# EAGLE design ESP32-Tinkler (EAGLE 8.1.1)
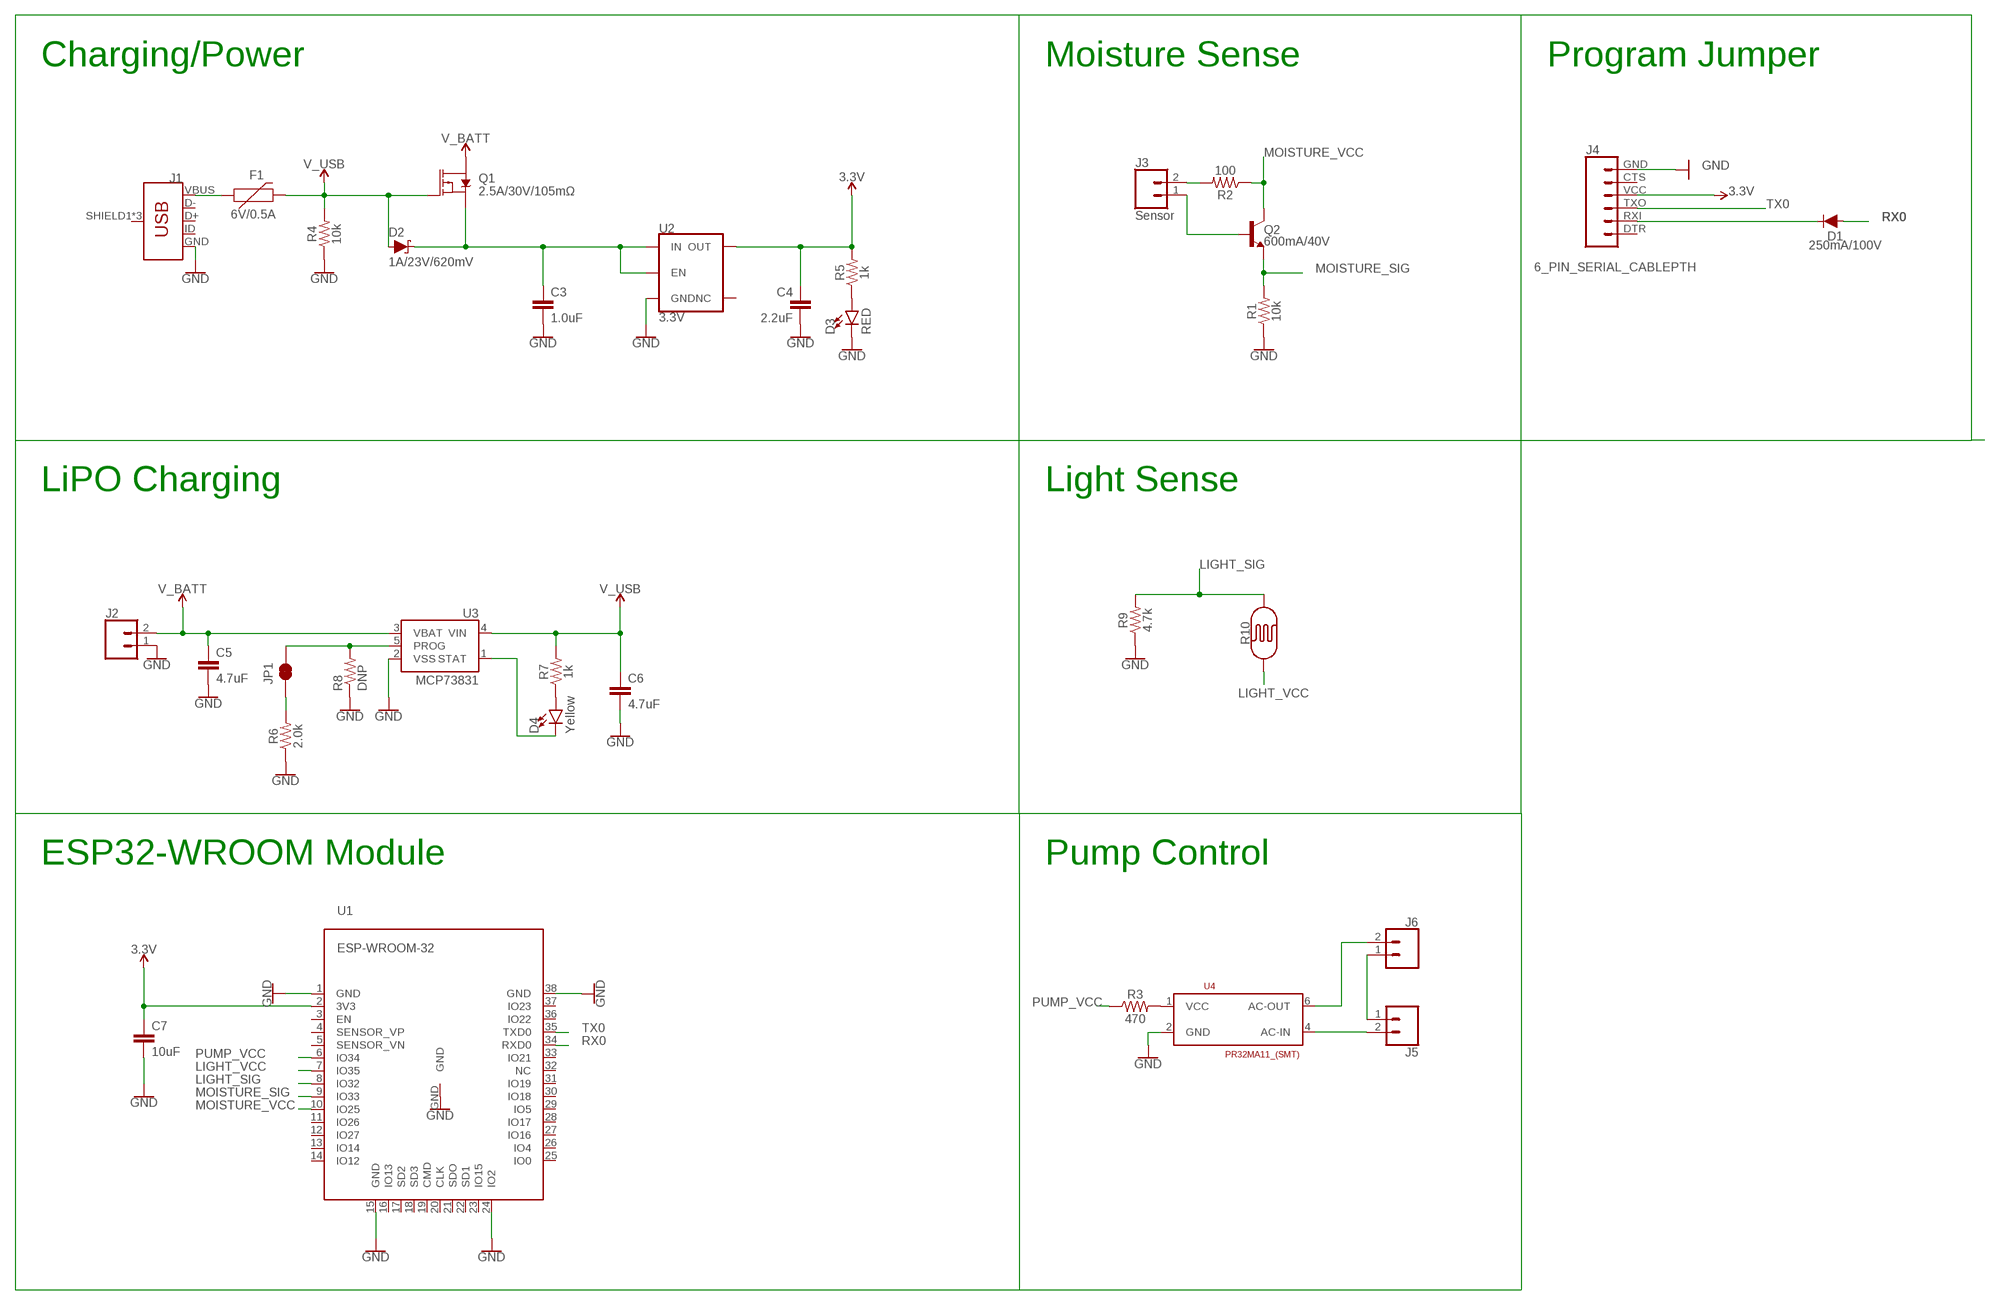
[diagram p0: schematic, sheet 1]

## Parts
C3  1.0uF  1.0UF-0603-16V-10%  [0603]
C4  2.2uF  2.2UF-0603-10V-20%  [0603]
C5  4.7uF  4.7UF0603  [0603]
C6  4.7uF  4.7UF0603  [0603]
C7  10uF  10UF-0603-6.3V-20%  [0603]
D1  250mA/100V  DIODE-BAS16J  [SOD-323]
D2  1A/23V/620mV  DIODE-SCHOTTKY-BAT20J  [SOD-323]
D3  RED  LED-RED0603  [LED-0603]
D4  Yellow  LED-YELLOW0603  [LED-0603]
F1  6V/0.5A  PPTC_HALF-AMP  [1206]
J1  USB_MICRO-B_FEMALE-SMT  [USB-B-MICRO-SMD]
J2  CONN_02JST-PTH-2  [JST-2-PTH]
J3  Sensor  CONN_02JST-PTH-2  [JST-2-PTH]
J4  6_PIN_SERIAL_CABLEPTH  [FTDI_BASIC]
J5  CONN_02PTH4  [1X02_XTRA_BIG]
J6  CONN_02PTH4  [1X02_XTRA_BIG]
JP1  JUMPER-SMT_2_NC_TRACE_SILK  [SMT-JUMPER_2_NC_TRACE_SILK]
Q1  2.5A/30V/105mΩ  MOSFET_PCH-DMG2307L  [SOT23-3]
Q2  600mA/40V  TRANS_NPN-MMBT2222AL  [SOT23-3]
R1  10k  10KOHM-0603-1/10W-1%  [0603]
R2  100  100OHM-0603-1/4W-5%  [0603]
R3  470  470OHM-0603-1/10W-1%  [0603]
R4  10k  10KOHM-0603-1/10W-1%  [0603]
R5  1k  1KOHM-0603-1/10W-1%  [0603]
R6  2.0k  2.0KOHM-0603-1/10W-5%  [0603]
R7  1k  1KOHM-0603-1/10W-1%  [0603]
R8  DNP  RESISTOR0603-RES  [0603-RES]
R9  4.7k  4.7KOHM-0603-1/10W-1%  [0603]
R10  PHOTOCELLPTH-KIT  [PHOTOCELL-KIT]
U1  ESP-WROOM-32  [ESP-WROOM-32]
U2  3.3V  V_REG_AP2112K-3.3V  [SOT23-5]
U3  MCP73831  [SOT23-5]
U4  PR32MA11_(SMT)  [SMT-GULLWING]

## Nets
3.3V: C4.1 C7.1 J4.VCC R5.2 U1.2(3V3) U2.5(OUT)
GND: C3.2 C4.2 C5.2 C6.2 C7.2 D3.C J1.GND J2.1 J4.GND R1.1 R4.1 R6.1 R8.1 R9.1 U1.1(GND) U1.15(GND) U1.24(IO2) U1.38(GND) U1.GND U2.2(GND) U3.2(VSS) U4.2(GND)
LIGHT_SIG: R9.2 R10.2 U1.8(IO32)
LIGHT_VCC: R10.1 U1.7(IO35)
MOISTURE_SIG: Q2.2(E) R1.2 U1.9(IO33)
MOISTURE_VCC: Q2.3(C) R2.1 U1.10(IO25)
N$1: J3.2 R2.2
N$2: F1.1 J1.VBUS
N$3: C3.1 D2.C Q1.2(S) U2.1(IN) U2.3(EN)
N$4: J3.1 Q2.1(B)
N$5: D1.C J4.RXI
N$6: JP1.2 R8.2 U3.5(PROG)
N$7: D3.A R5.1
N$9: D4.A R7.1
N$10: JP1.1 R6.2
N$11: J5.1 J6.1
N$12: D4.C U3.1(STAT)
N$13: J6.2 U4.6(AC-OUT)
N$14: J5.2 U4.4(AC-IN)
N$16: R3.2 U4.1(VCC)
PUMP_VCC: R3.1 U1.6(IO34)
RX0: D1.A U1.34(RXD0)
TX0: J4.TXO U1.35(TXD0)
V_BATT: C5.1 J2.2 Q1.3(D) U3.3(VBAT)
V_USB: C6.1 D2.A F1.2 Q1.1(G) R4.2 R7.2 U3.4(VIN)
Unconnected: J1.D+ J1.D- J1.ID J1.SHIELD1(SHIELD) J1.SHIELD2(SHIELD) J1.SHIELD3(SHIELD) J4.CTS J4.DTR U1.3(EN) U1.4(SENSOR_VP) U1.5(SENSOR_VN) U1.11(IO26) U1.12(IO27) U1.13(IO14) U1.14(IO12) U1.16(IO13) U1.17(SD2) U1.18(SD3) U1.19(CMD) U1.20(CLK) U1.21(SDO) U1.22(SD1) U1.23(IO15) U1.25(IO0) U1.26(IO4) U1.27(IO16) U1.28(IO17) U1.29(IO5) U1.30(IO18) U1.31(IO19) U1.32(NC) U1.33(IO21) U1.36(IO22) U1.37(IO23) U2.4(NC)

## Notes on the sheet
- Charging/Power | Moisture Sense | Program Jumper
- LiPO Charging | Light Sense
- ESP32-WROOM Module | Pump Control

## Library data of the parts
C3 = SparkFun-Capacitors:1.0UF: 1µF ceramic capacitors A capacitor is a passive two-terminal electrical component used to store electrical energy temporarily in an electric field.; PROD_ID: CAP-00868
C4 = SparkFun-Capacitors:2.2UF: 2.2µF ceramic capacitors A capacitor is a passive two-terminal electrical component used to store electrical energy temporarily in an electric field.; PROD_ID: CAP-07888
C5 C6 = SparkFun-Capacitors:4.7UF: 4.7µF ceramic capacitors A capacitor is a passive two-terminal electrical component used to store electrical energy temporarily in an electric field.; PROD_ID: CAP-08280
C7 = SparkFun-Capacitors:10UF: 10.0µF ceramic capacitors A capacitor is a passive two-terminal electrical component used to store electrical energy temporarily in an electric field.; PROD_ID: CAP-11015
D1 = SparkFun-DiscreteSemi:DIODE: Diode These are standard reverse protection diodes and small signal diodes. SparkFun Products: SparkFun SparkPunk Sound Kit <https://www.sparkfun.com/products/11177> SparkFun ESP8266 Thing <https://www.sparkfun.com/products/13231>; PROD_ID: DIO-09646
D2 = SparkFun-DiscreteSemi:DIODE-SCHOTTKY: Schottky diode A Schottky diode is a semiconductor diode which has a low forward voltage drop and a very fast switching action.; PROD_ID: DIO-11623
D3 = SparkFun-LED:LED-RED: Red SMD LED Used in manufacturing of most products at SparkFun Packages: 0603 - SMD 0603 package [Product Link] <http://docs.avagotech.com/docs/AV02-0551EN> 0603 SMART - SMD 0603 SMART package ( more efficient and expensive)[Product Link] <http://www.osram-os.com/Graphics/XPic2/00077099_0.pdf> 1206 - SMD1206 package [Product Link] <https://www.sparkfun.com/datasheets/DevTools/LilyPad/Q150OVS4.pdff> SparkFun Products: Pro Mini 328 -5V <https://www.sparkfun.com/products/821> RedBoard <https://www.sparkfun.com/products/12757> IOIO-OTG <https://www.sparkfun.com/products/13613>; PROD_ID: DIO-00819
D4 = SparkFun-LED:LED-YELLOW: Yellow SMD LED Used in manufacturing several products at SparkFun. Packages: 0603 - SMD 0603 package[Product Link] <http://www.kingbrightusa.com/product.asp?catalog_name=LED&product_id=APT1608SYCK> 0603 -SMART - SMART SMD 0603 package (more efficient/more expensive) [Product Link] <http://www.osram-os.com/osram_os/en/products/product-catalog/led-light-emitting-diodes/smartled-0603/ly-l29k/index.jsp> LilyPad - SMD1206 package[Product Datasheet] <https://www.sparkfun.com/datasheets/DevTools/LilyPad/Q150YUS4.pdf> SparkFun Products: Blynk Board <https://www.sparkfun.com/products/13794> IOIO-OTG <https://www.sparkfun.com/products/13613> XBee Explorer Serial <https://www.sparkfun.com/products/13225>; PROD_ID: DIO-09003
F1 = SparkFun-Fuses:PPTC: Resettable Fuse PPTC Resettable Fuse. Really a sort of resistor with a polymeric positive temperature coefficient whose resistance increases dramatically with an increase in temperature. When heated by the power passing through the resistance rises causing the current to be limited, protecting the circuit. This is achieved by the transition of the polymer from a crystalline to an amorphous state where the conductive carbon separates breaking the conductive pathways found in the cool crystalline structure. When a PPTC cools back down it resumes conducting letting the circuit turn back on. SparkFun Products: SparkFun RedBoard - Programmed with Arduino <https://www.sparkfun.com/products/12757> Pro Micro - 5V/16MHz <https://www.sparkfun.com/products/12640> Arduino Pro 328 - 5V/16MHz <https://www.sparkfun.com/products/10915> MP3 Trigger <https://www.sparkfun.com/products/13720>; PROD_ID: RES-08585
J1 = SparkFun-Connectors:USB_MICRO-B: USB Type Micro-B Connector Male/female and PTH/SMT variants SparkFun Products: SparkFun microB USB Breakout <https://www.sparkfun.com/products/12035> SparkFun USB microB Plug Breakout <https://www.sparkfun.com/products/10031> SparkFun ESP8266 Thing <https://www.sparkfun.com/products/13231>; PROD_ID: CONN-11752
J2 J3 = SparkFun-Connectors:CONN_02: Multi connection point. Often used as Generic Header-pin footprint for 0.1 inch spaced/style header connections On any of the 0.1 inch spaced packages, you can populate with these: Break Away Headers - Straight <https://www.sparkfun.com/products/116> (PRT-00116) Break Away Male Headers - Right Angle <https://www.sparkfun.com/products/553> (PRT-00553) Female Headers <https://www.sparkfun.com/products/115> (PRT-00115) Break Away Headers - Machine Pin <https://www.sparkfun.com/products/117> (PRT-00117) Break Away Female Headers - Swiss Machine Pin <https://www.sparkfun.com/products/743> (PRT-00743) For SCREWTERMINALS and SPRING TERMINALS visit here: Screw Terimnals on SparkFun.com <https://www.sparkfun.com/search/results?term=Screw+Terminals> (5mm/3.5mm/2.54mm spacing) This device is also useful as a general connection point to wire up your design to another part of your project. Our various solder wires solder well into these plated through hole pads. Hook-Up Wire - Assortment (Stranded, 22 AWG) <https://www.sparkfun.com/products/11375> (PRT-11375) Hook-Up Wire - Assortment (Solid Core, 22 AWG) <https://www.sparkfun.com/products/11367> (PRT-11367) View the entire wire category on our website here <https://www.sparkfun.com/categories/141> Special notes: Molex polarized connector foot print use with: PRT-08233 with associated crimp pins and housings. 2.54_SCREWTERM for use with PRT-10571. 3.5mm Screw Terminal footprints for PRT-08084 5mm Screw Terminal footprints for use with PRT-08432; PROD_ID: CONN-09863; SKU: PRT-09914
J4 = SparkFun-Connectors:6_PIN_SERIAL_CABLE: 6-pin header connection for use with the "FTDI BASIC" pinout - CABLE SIDE. Also known as "Arduino Serial Program Header". This is used on a design to provide a 6-pin connection point for serial communication usually from a USB cable (D+/D-) to these headers (RX/TX). It also has the remaining pins necessary for programming in the Arduino evironment (DTR, GND, and sometimes VCC). Note, this device has "CABLE" in the name. It is intended to be used on a design that usually lives on the end of your USB cable and prvides the converter chip (FTDI232 or FTDI231x) to commnicate serial RX/TX. The "sister" device, named "TARGET" is inteneded to be used on a design that contains a target micro-controller that you wish to program. You can populate with some of these: Female Headers <https://www.sparkfun.com/products/115> (PRT-00115) For reference (or to suit your programming needs) check out these designs: SparkFun FTDI Basic Breakout - 5V <https://www.sparkfun.com/products/9716> (DEV-09716) SparkFun FTDI Basic Breakout - 3.3V <https://www.sparkfun.com/products/9873> (DEV-09873) SparkFun FTDI SmartBasic <https://www.sparkfun.com/products/12935> (DEV-12935) SparkFun Beefy 3 - FTDI Basic Breakout <https://www.sparkfun.com/products/13746> (DEV-13746)
J5 J6 = SparkFun-Connectors:CONN_02: Multi connection point. Often used as Generic Header-pin footprint for 0.1 inch spaced/style header connections On any of the 0.1 inch spaced packages, you can populate with these: Break Away Headers - Straight <https://www.sparkfun.com/products/116> (PRT-00116) Break Away Male Headers - Right Angle <https://www.sparkfun.com/products/553> (PRT-00553) Female Headers <https://www.sparkfun.com/products/115> (PRT-00115) Break Away Headers - Machine Pin <https://www.sparkfun.com/products/117> (PRT-00117) Break Away Female Headers - Swiss Machine Pin <https://www.sparkfun.com/products/743> (PRT-00743) For SCREWTERMINALS and SPRING TERMINALS visit here: Screw Terimnals on SparkFun.com <https://www.sparkfun.com/search/results?term=Screw+Terminals> (5mm/3.5mm/2.54mm spacing) This device is also useful as a general connection point to wire up your design to another part of your project. Our various solder wires solder well into these plated through hole pads. Hook-Up Wire - Assortment (Stranded, 22 AWG) <https://www.sparkfun.com/products/11375> (PRT-11375) Hook-Up Wire - Assortment (Solid Core, 22 AWG) <https://www.sparkfun.com/products/11367> (PRT-11367) View the entire wire category on our website here <https://www.sparkfun.com/categories/141> Special notes: Molex polarized connector foot print use with: PRT-08233 with associated crimp pins and housings. 2.54_SCREWTERM for use with PRT-10571. 3.5mm Screw Terminal footprints for PRT-08084 5mm Screw Terminal footprints for use with PRT-08432
JP1 = SparkFun-Jumpers:JUMPER-SMT_2_NC_TRACE: Normally closed trace jumper This jumper has a trace between two pads so it's normally closed (NC). Use a razor knife to open the connection. For best results follow the IPC guidelines for cutting traces: Cutout at least 0.063 mm (0.005 in). Remove all loose material to clean up the cut area. Seal the cut with an approved epoxy. Reapply solder to reclose the connection.
Q1 = SparkFun-DiscreteSemi:MOSFET_PCH: P-channel MOSFETs Voltage controlled devices that allow control of high current outputs. SparkFun Products: SparkFun ESP32 Thing <https://www.sparkfun.com/products/13907> SparkFun ESP8266 Thing <https://www.sparkfun.com/products/13231>; PROD_ID: TRANS-11308
Q2 = SparkFun-DiscreteSemi:TRANS_NPN: NPN transistor Current controlled devices typically used to amplify current or used as a switch. BC547 - COM-08928 <http://www.sparkfun.com/products/8928> (TO-92 45V 100mA) (1.Collector 2.Base 3.Emitter) 2N3904 - COM-00521 <http://www.sparkfun.com/products/521> (TO-92 40V 200mA) (1.Emitter 2.Base 3.Collector) P2N2222A - COM-12852 <http://www.sparkfun.com/products/12852> (TO-92 40V 600mA) (1.Collector 2.Base 3.Emitter); PROD_ID: TRANS-08049
R1 R4 = SparkFun-Resistors:10KOHM: 10kΩ resistor A resistor is a passive two-terminal electrical component that implements electrical resistance as a circuit element. Resistors act to reduce current flow, and, at the same time, act to lower voltage levels within circuits. - Wikipedia; PROD_ID: RES-00824
R2 = SparkFun-Resistors:100OHM: 100Ω resistor A resistor is a passive two-terminal electrical component that implements electrical resistance as a circuit element. Resistors act to reduce current flow, and, at the same time, act to lower voltage levels within circuits. - Wikipedia; PROD_ID: RES-12438
R3 = SparkFun-Resistors:470OHM: 470Ω resistor A resistor is a passive two-terminal electrical component that implements electrical resistance as a circuit element. Resistors act to reduce current flow, and, at the same time, act to lower voltage levels within circuits. - Wikipedia; PROD_ID: RES-07869
R5 R7 = SparkFun-Resistors:1KOHM: 1kΩ resistor A resistor is a passive two-terminal electrical component that implements electrical resistance as a circuit element. Resistors act to reduce current flow, and, at the same time, act to lower voltage levels within circuits. - Wikipedia; PROD_ID: RES-07856
R6 = SparkFun-Resistors:2.0KOHM: 2kΩ resistor A resistor is a passive two-terminal electrical component that implements electrical resistance as a circuit element. Resistors act to reduce current flow, and, at the same time, act to lower voltage levels within circuits. - Wikipedia; PROD_ID: RES-08296
R8 = SparkFun-Passives:RESISTOR: Resistor Basic schematic elements and footprints for 0603, 1206, and PTH resistors.
R9 = SparkFun-Resistors:4.7KOHM: 4.7kΩ resistor A resistor is a passive two-terminal electrical component that implements electrical resistance as a circuit element. Resistors act to reduce current flow, and, at the same time, act to lower voltage levels within circuits. - Wikipedia; PROD_ID: RES-07857
R10 = SparkFun-Sensors:PHOTOCELL: Photocell (Photodetector, Photo Resistor, CdS) This is a very small light sensor. A photocell changes (also called a photodetector, photo resistor, CdS or photoconductive cell) resistance depending on the amount of light it is exposed to. These little sensors make great ambient light triggers (when light in the room turns on, do something). Datasheet <http://cdn.sparkfun.com/datasheets/Sensors/LightImaging/SEN-09088.pdf> SparkFun Products Mini Photocell <https://www.sparkfun.com/products/9088> (SEN-09088); PROD_ID: COMP-09129; SF_ID: SEN-09088
U1 = esp32:ESP-WROOM-32
U2 = SparkFun-IC-Power:V_REG_AP2112: AP2112 - 600mA CMOS LDO Regulator w/ Enable The AP2112 is CMOS process low dropout linear regulator with enable function, the regulator delivers a guaranteed 600mA (min.) continuous load current. Features Output Voltage Accuracy: ±1.5% Output Current: 600mA (Min.) Foldback Short Current Protection: 50mA Enable Function to Turn ON/OFF VOUT Low Dropout Voltage (3.3V): 250mV (Typ.) @IOUT=600mA Excellent Load Regulation: 0.2%/A (Typ.) Excellent Line Regulation: 0.02%/V (Typ.) Low Quiescent Current: 55μA (Typ.) Low Standby Current: 0.01μA (Typ.) Low Output Noise: 50μVRMS PSRR: 100Hz -65dB, 1kHz -65dB OTSD Protection Stable with 1.0μF Flexible Cap: Ceramic, Tantalum and Aluminum Electrolytic Operation Temperature Range: -40°C to 85°C ESD: MM 400V, HBM 4000V; PROD_ID: VREG-12457
U3 = SparkFun-IC-Power:MCP73831: MCP73831T Li-Ion, Li-Pol Controller Miniature single cell, fully integrated Li-Ion, Li-polymer charge management controller Datasheet <http://ww1.microchip.com/downloads/en/DeviceDoc/20001984g.pdf> SparkFun Products: SparkFun ESP32 Thing <https://www.sparkfun.com/products/13907> SparkFun 9DoF Razor IMU M0 <https://www.sparkfun.com/products/14001>; PROD_ID: IC-09995
U4 = SparkFun-DiscreteSemi:PR32MA11_(SMT): PR32MA11 Solid State Relay (600V)

## Board
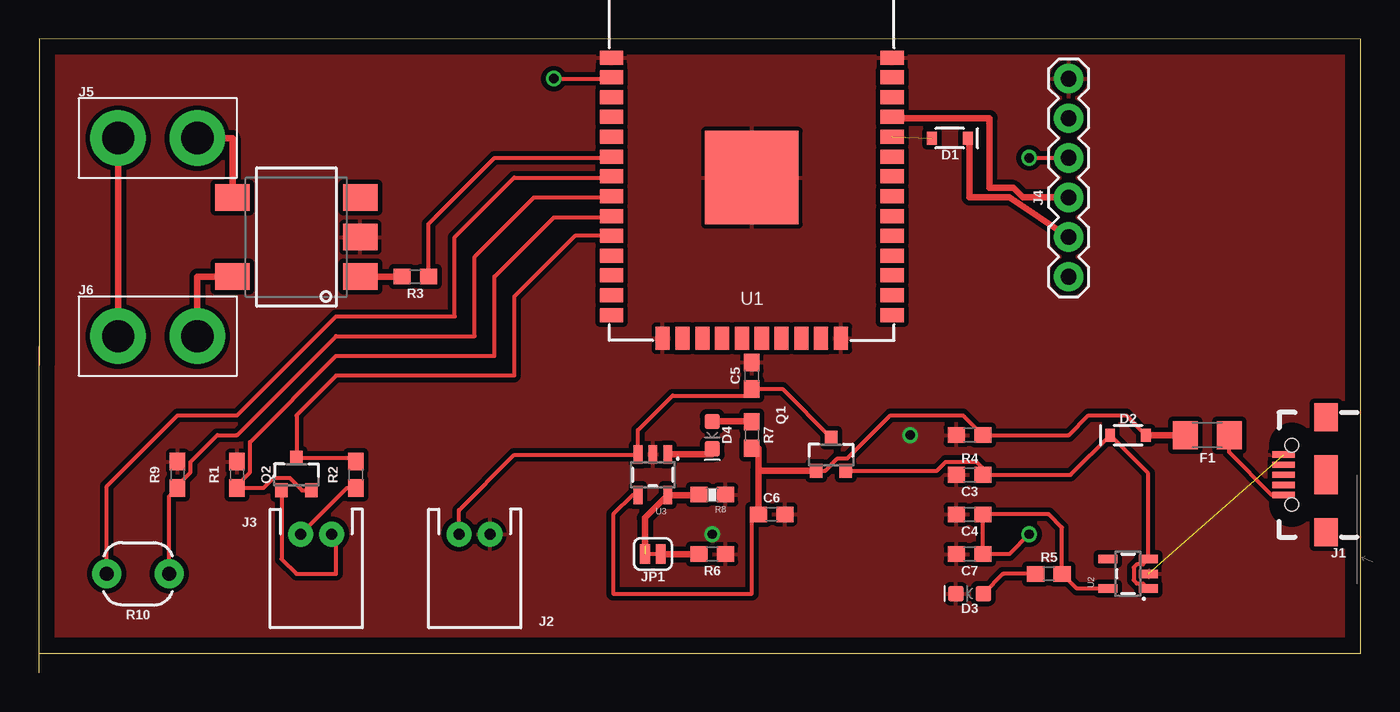
[diagram p1: board, top side]
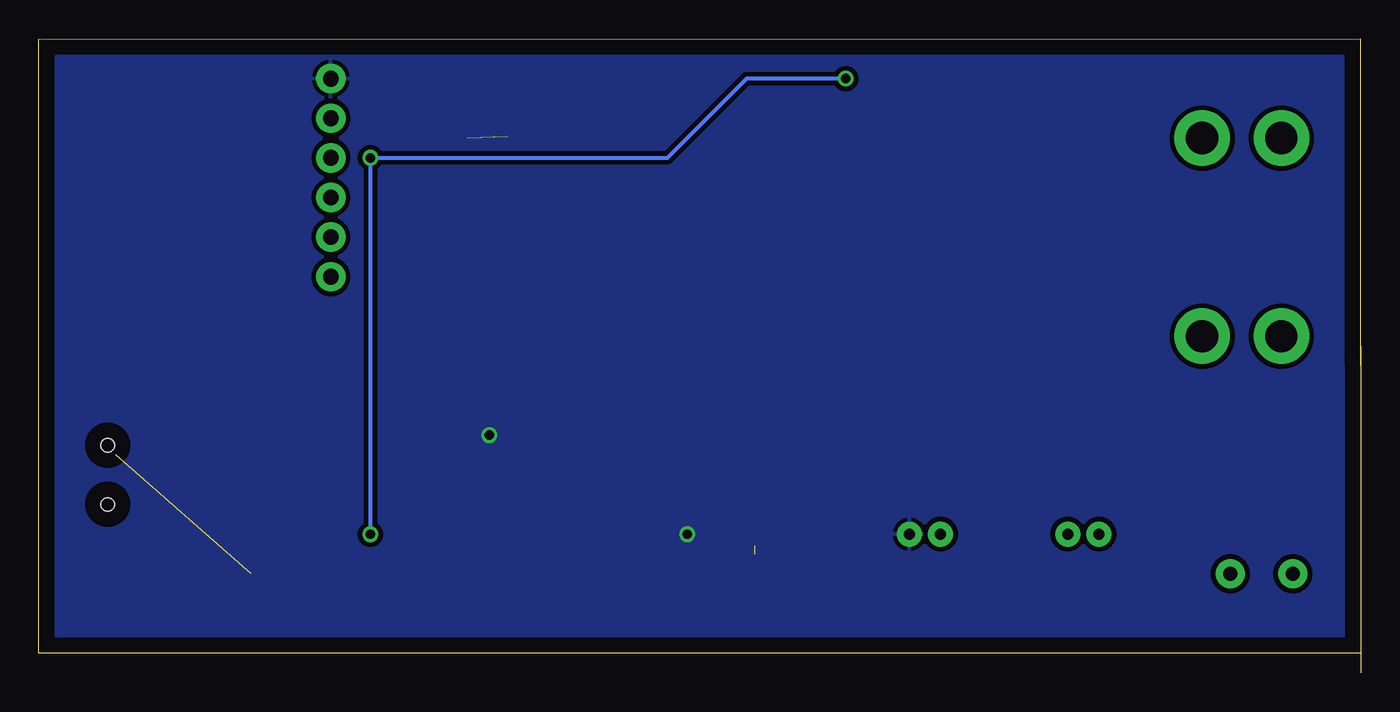
[diagram p2: board, bottom side, seen from below]

Size 84.76 x 40.64 mm. Coordinates in mm from the lower left corner, seen from the top.
Outline: 0.01,39.37 0,0
Outline: 0,1.27 84.76,1.27 84.76,40.63 0.01,40.64 0,1.27
Copper layers (1*16): Top 0.035mm / dielectric 1.5mm / Bottom 0.035mm
Design rules "default": minimum track width 10mil, minimum drill 24mil, track to track 8mil, track to pad 8mil, pad to pad 8mil, via to via 8mil, smd to smd 8mil, copper to edge 40mil, drill to drill 8mil, minimum pad ring 10mil, minimum via ring 8mil, stop-mask expansion 4mil, vias tented up to drill 0mil, thermal gap 10mil

### Footprints (pad centres in the part's own frame; a part is rotated, then mirrored left to right if it is on the bottom)
0603 = smd 1.1 x 1: 1 -0.85,0; 2 0.85,0
SOD-323 = smd 0.63 x 0.83: A 1.15,0; C -1.15,0
LED-0603 = smd 1 x 1: A -0.877,0; C 0.877,0
1206 = smd 1.6 x 1.8: 1 -1.4,0; 2 1.4,0
USB-B-MICRO-SMD = smd 1.45 x 0.4: D+ 2.725,0; D- 2.725,0.65; GND 2.725,-1.3; ID 2.725,-0.65; VBUS 2.725,1.3 | smd 1.5 x 1.8: SHIELD1 0,3.685; SHIELD2 0,-3.685 | smd 1.5 x 2.5: SHIELD3 0,0 | hole 0.85: 2.2,1.9; 2.2,-1.9
JST-2-PTH = drill 0.7 pad 1.6: 1 -1,0; 2 1,0
FTDI_BASIC = drill 1.016 pad 1.88: CTS 10.16,0; DTR 0,0; GND 12.7,0; RXI 2.54,0; TXO 5.08,0; VCC 7.62,0
1X02_XTRA_BIG = drill 2.057 pad 3.556: 1 -2.54,0; 2 2.54,0
SMT-JUMPER_2_NC_TRACE_SILK = smd 0.635 x 1.27: 1 -0.508,0; 2 0.508,0
SOT23-3 = smd 0.8 x 0.9: 1 -0.95,-1; 2 0.95,-1; 3 0,1.1
0603-RES = smd 1.1 x 1: 1 -0.85,0; 2 0.85,0
PHOTOCELL-KIT = drill 0.9 pad 1.88: 1 -2,0; 2 2,0
ESP-WROOM-32 = smd 0.9 x 1.5: 1 7.7,9; 2 6.43,9; 3 5.16,9; 4 3.89,9; 5 2.62,9; 6 1.35,9; 7 0.08,9; 8 -1.19,9; 9 -2.46,9; 10 -3.73,9; 11 -5,9; 12 -6.27,9; 13 -7.54,9; 14 -8.81,9; 25 -8.81,-9; 26 -7.54,-9; 27 -6.27,-9; 28 -5,-9; 29 -3.73,-9; 30 -2.46,-9; 31 -1.19,-9; 32 0.08,-9; 33 1.35,-9; 34 2.62,-9; 35 3.89,-9; 36 5.16,-9; 37 6.43,-9; 38 7.7,-9 | smd 1.5 x 0.9: 15 -10.3,5.715; 16 -10.3,4.445; 17 -10.3,3.175; 18 -10.3,1.905; 19 -10.3,0.635; 20 -10.3,-0.635; 21 -10.3,-1.905; 22 -10.3,-3.175; 23 -10.3,-4.445; 24 -10.3,-5.715 | smd 6 x 6: GND 0,0
SOT23-5 = smd 0.55 x 1.2: 1 -0.95,-1.3; 2 0,-1.3; 3 0.95,-1.3; 4 0.95,1.3; 5 -0.95,1.3
SMT-GULLWING = smd 1.7 x 2.2: 1 -2.54,-4.1; 2 0,-4.1; 3 2.54,-4.1; 4 2.54,4.1; 6 -2.54,4.1

### Placement (x,y rotation side)
C3  59.69,12.7 180 top
C4  59.69,10.16 180 top
C5  45.72,19.05 90 top
C6  46.99,10.16 0 top
C7  59.69,7.62 180 top
D1  58.42,34.29 180 top
D2  69.85,15.24 0 top
D3  59.69,5.08 180 top
D4  43.18,15.24 270 top
F1  74.93,15.24 180 top
J1  82.55,12.7 180 top
J2  27.94,8.89 180 top
J3  17.78,8.89 180 top
J4  66.04,25.4 90 top
J5  7.62,34.29 0 top
J6  7.62,21.59 0 top
JP1  39.37,7.62 180 top
Q1  50.8,13.97 0 top
Q2  16.51,12.7 0 top
R1  12.7,12.7 270 top
R2  20.32,12.7 270 top
R3  24.13,25.4 180 top
R4  59.69,15.24 0 top
R5  64.77,6.35 0 top
R6  43.18,7.62 180 top
R7  45.72,15.24 270 top
R8  43.18,11.43 180 top
R9  8.89,12.7 270 top
R10  6.35,6.35 0 top
U1  45.72,31.75 90 top
U2  69.85,6.35 90 top
U3  39.37,12.7 180 top
U4  16.51,27.94 90 top

### Tracks (layer width: path | path; a pad name or v marks a point on that pad's centre or on a via)
3.3V  (via drill 0.6)
  Top 0.254: U2.5 66.57,5.4 R5.2 65.62,9.31 64.77,10.16 C4.1 C7.1 62.23,7.62 v63.5,8.89 | v63.5,33.02 J4.VCC | v33.02,38.1 36.64,38.1 U1.2
  Bottom 0.254: v33.02,38.1 39.37,38.1 44.45,33.02 v63.5,33.02 v63.5,8.89
GND  (via drill 0.6)  (1 unrouted)
  other vias: 55.88,15.24 43.18,8.89
  pour Bottom (isolate 0.305): 0,40.64 85.09,40.64 85.09,1.27 0,1.27
  pour Top (isolate 0.305): 0,40.64 85.09,40.64 85.09,1.27 0,1.27
LIGHT_SIG
  Top 0.254: R10.2 8.35,11.31 R9.2 8.89,12.03 9.72,12.86 9.72,13.53 11.43,15.24 12.7,15.24 19.05,21.59 27.94,21.59 27.94,26.67 31.75,30.48 36.64,30.48 U1.8
LIGHT_VCC
  Top 0.254: R10.1 4.35,11.97 8.89,16.51 12.7,16.51 19.05,22.86 26.67,22.86 26.67,27.94 30.48,31.75 36.64,31.75 U1.7
MOISTURE_SIG
  Top 0.254: Q2.2 16.88,11.7 16.1,12.48 15.02,12.48 14.39,11.85 R1.2 12.7,12.03 13.53,12.86 13.53,14.8 19.05,20.32 29.21,20.32 29.21,25.4 33.02,29.21 36.64,29.21 U1.9
MOISTURE_VCC
  Top 0.254: R2.1 20.07,13.8 Q2.3 16.51,16.51 19.05,19.05 30.48,19.05 30.48,24.13 34.37,28.02 U1.10
N$1
  Top 0.254: R2.2 19.74,11.85 J3.2
N$2
  Top 0.254: F1.1 76.33,14.15 79.08,11.4 J1.VBUS
N$3
  Top 0.254: U2.1 70.81,5.74 70.41,5.74 70.22,5.94 70.22,6.76 70.41,6.96 70.81,6.96 U2.3 71.15,12.79 D2.C 66.16,12.7 60.96,12.7 | 60.96,12.7 C3.1 | Q1.2 57.59,12.97 58.15,13.53 60.13,13.53 60.96,12.7
N$4
  Top 0.254: Q2.1 15.56,7.3 16.51,6.35 19.05,6.35 19.05,8.62 J3.1
N$5
  Top 0.406: D1.C 59.69,34.29 59.69,30.48 62.23,30.48 J4.RXI
N$6  (1 unrouted)
  Top 0.406: 38.86,8.15 38.86,9.94 U3.5 42.33,11.4 R8.2
N$7
  Top 0.254: R5.1 61.84,6.35 D3.A
N$9
  Top 0.406: D4.A 45.72,16.12 R7.1
N$10
  Top 0.406: JP1.1 R6.2
N$11
  Top 0.406: J5.1 J6.1
N$12
  Top 0.406: U3.1 43.18,14 D4.C
N$13
  Top 0.406: U4.6 10.16,25.4 J6.2
N$14
  Top 0.406: J5.2 12.41,34.29 U4.4
N$16
  Top 0.406: U4.1 R3.2
PUMP_VCC
  Top 0.254: R3.1 24.98,28.79 29.21,33.02 36.64,33.02 U1.6
RX0  (1 unrouted)
TX0
  Top 0.406: J4.TXO 63.09,30.48 62.48,31.09 60.96,31.09 60.96,35.56 54.72,35.56 U1.35
V_BATT
  Top 0.254: Q1.3 47.67,18.2 C5.1 45.3,17.78 40.64,17.78 38.42,15.56 U3.3 38.39,13.97 30.48,13.97 26.94,10.43 J2.2
V_USB
  Top 0.254: D2.A 69.73,16.51 67.31,16.51 66.04,15.24 R4.2 59.27,16.51 54.61,16.51 51.85,13.75 51.21,13.75 50.43,12.97 Q1.1 | U3.4 38.07,11.4 36.83,10.16 36.83,5.08 45.72,5.08 45.72,9.74 C6.1
  Top 0.406: D2.A F1.2 | 46.14,12.97 Q1.1 | C6.1 46.14,12.97 | R7.2 46.14,14.39 46.14,12.97

### Text on the board
tDocu: Tinkler_b0.1 | TYGER ONE